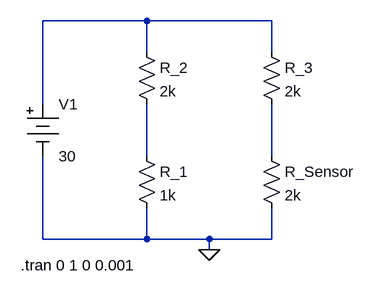
[diagram p0: schematic projeto_ponte_wheatstone.asc]
projeto_ponte_wheatstone.asc, the LTspice schematic file:
Version 4
SHEET 1 880 680
WIRE 144 16 -16 16
WIRE 336 16 144 16
WIRE 144 64 144 16
WIRE 336 64 336 16
WIRE -16 144 -16 16
WIRE 144 224 144 144
WIRE 336 224 336 144
WIRE -16 352 -16 224
WIRE 144 352 144 304
WIRE 144 352 -16 352
WIRE 240 352 144 352
WIRE 336 352 336 304
WIRE 336 352 240 352
WIRE 240 368 240 352
FLAG 240 368 0
SYMBOL res 128 48 R0
SYMATTR InstName R_2
SYMATTR Value 2k
SYMBOL res 320 48 R0
SYMATTR InstName R_3
SYMATTR Value 2k
SYMBOL res 320 208 R0
SYMATTR InstName R_Sensor
SYMATTR Value 2k
SYMBOL res 128 208 R0
SYMATTR InstName R_1
SYMATTR Value 1k
SYMBOL Misc\\battery -16 128 R0
WINDOW 123 0 0 Left 0
WINDOW 39 0 0 Left 0
SYMATTR InstName V1
SYMATTR Value 30
TEXT -50 392 Left 2 !.tran 0 1 0 0.001

The netlist it stands for:
* projeto_ponte_wheatstone.asc
R_2 N001 N002 2k
R_3 N001 N003 2k
R_Sensor N003 0 2k
R_1 N002 0 1k
V1 N001 0 30
.tran 0 1 0 0.001
.backanno
.end